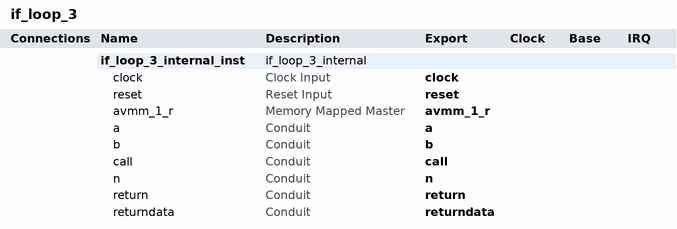
[diagram p0: system contents]
# Platform Designer (Qsys) system if_loop_3, Cyclone V 5CSEMA4U23C7
# Parameters at their usual value, and those the tool derives, are not listed.
package require qsys
create_system if_loop_3
set_project_property DEVICE_FAMILY {Cyclone V}
set_project_property DEVICE 5CSEMA4U23C7

add_instance if_loop_3_internal_inst if_loop_3_internal 1.0
set_instance_property if_loop_3_internal_inst AUTO_EXPORT true

# exported interfaces
add_interface a conduit end
set_interface_property a EXPORT_OF if_loop_3_internal_inst.a
add_interface avmm_1_r avalon master
set_interface_property avmm_1_r EXPORT_OF if_loop_3_internal_inst.avmm_1_r
add_interface b conduit end
set_interface_property b EXPORT_OF if_loop_3_internal_inst.b
add_interface call conduit end
set_interface_property call EXPORT_OF if_loop_3_internal_inst.call
add_interface clock clock sink
set_interface_property clock EXPORT_OF if_loop_3_internal_inst.clock
add_interface n conduit end
set_interface_property n EXPORT_OF if_loop_3_internal_inst.n
add_interface reset reset sink
set_interface_property reset EXPORT_OF if_loop_3_internal_inst.reset
add_interface return conduit end
set_interface_property return EXPORT_OF if_loop_3_internal_inst.return
add_interface returndata conduit end
set_interface_property returndata EXPORT_OF if_loop_3_internal_inst.returndata

set_interconnect_requirement {$system} qsys_mm.clockCrossingAdapter HANDSHAKE
set_interconnect_requirement {$system} qsys_mm.enableEccProtection FALSE
set_interconnect_requirement {$system} qsys_mm.insertDefaultSlave FALSE
set_interconnect_requirement {$system} qsys_mm.maxAdditionalLatency 1

save_system if_loop_3.qsys
